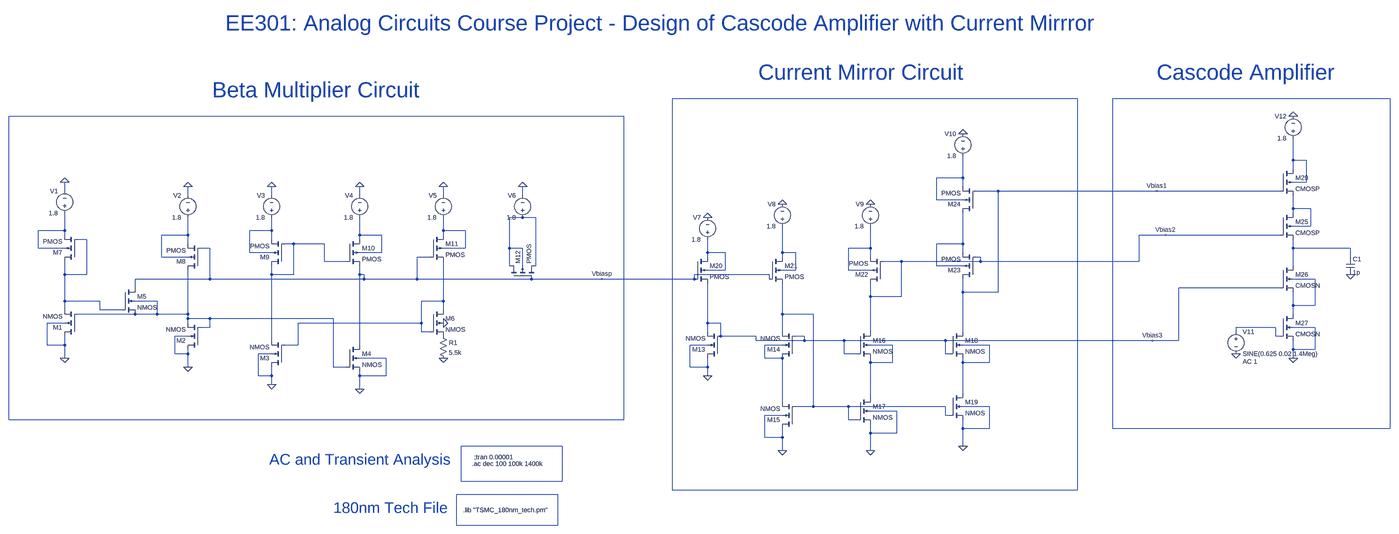
[diagram p0: schematic Cascode_Amplifier_Schematic_22nm.asc, whole sheet]
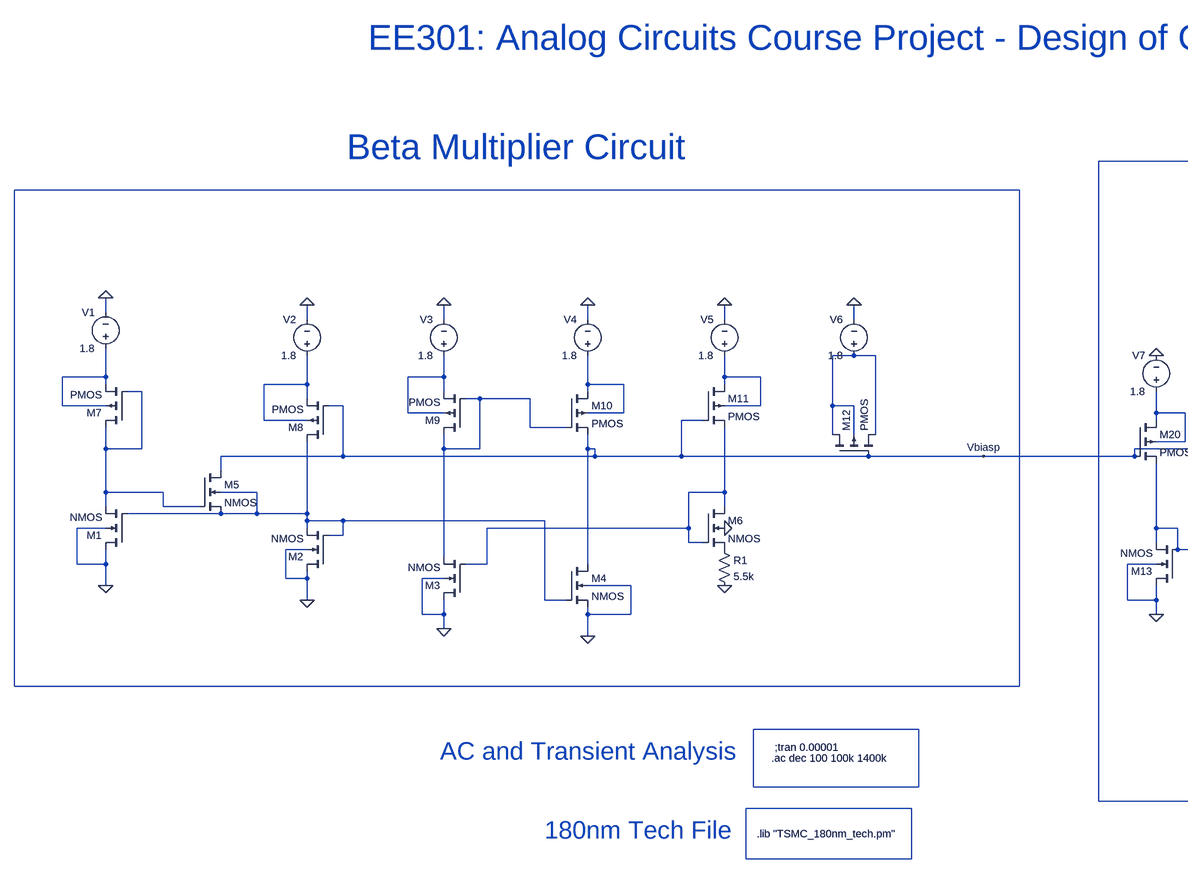
[diagram p1: schematic Cascode_Amplifier_Schematic_22nm.asc, part, row 1 of 1, column 1 of 2]
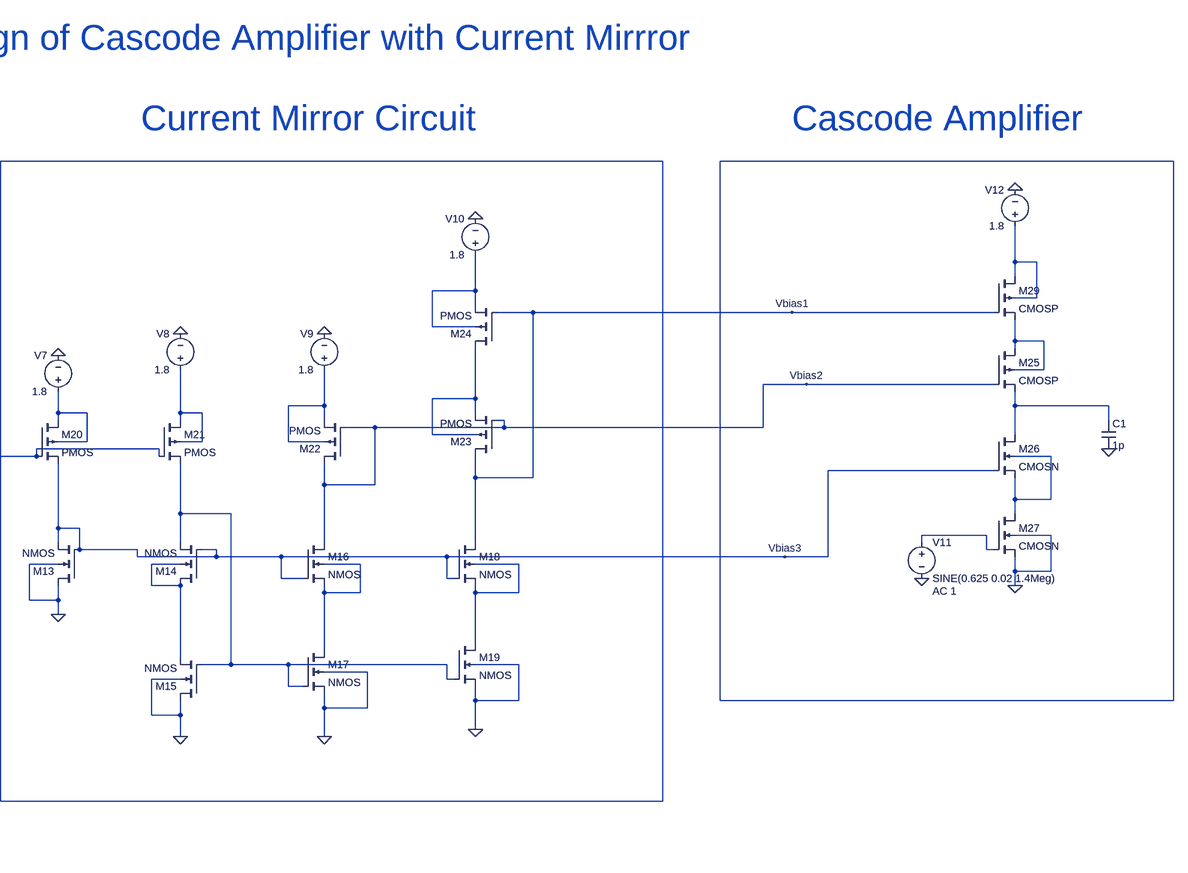
[diagram p2: schematic Cascode_Amplifier_Schematic_22nm.asc, part, row 1 of 1, column 2 of 2]
Cascode_Amplifier_Schematic_22nm.asc, the LTspice schematic file:
Version 4
SHEET 1 4960 980
WIRE 3712 -576 2240 -576
WIRE 4880 -576 3840 -576
WIRE 2064 -512 -176 -512
WIRE 4496 -352 4496 -432
WIRE 4544 -352 4496 -352
WIRE 4496 -320 4496 -352
WIRE 3296 -288 3296 -368
WIRE 3296 -288 3200 -288
WIRE 4544 -272 4544 -352
WIRE 4544 -272 4496 -272
WIRE 3296 -256 3296 -288
WIRE 32 -240 32 -272
WIRE 3424 -240 3344 -240
WIRE 4000 -240 3424 -240
WIRE 4448 -240 4000 -240
WIRE 480 -224 480 -256
WIRE 784 -224 784 -256
WIRE 1104 -224 1104 -256
WIRE 1408 -224 1408 -256
WIRE 1696 -224 1696 -256
WIRE 3200 -208 3200 -288
WIRE 3296 -208 3200 -208
WIRE 4496 -176 4496 -224
WIRE 4560 -176 4496 -176
WIRE 4496 -160 4496 -176
WIRE 1696 -144 1648 -144
WIRE 1744 -144 1696 -144
WIRE 4560 -112 4560 -176
WIRE 4560 -112 4496 -112
WIRE 32 -96 32 -160
WIRE 32 -96 -64 -96
WIRE 784 -96 784 -144
WIRE 784 -96 704 -96
WIRE 1408 -96 1408 -144
WIRE 1488 -96 1408 -96
WIRE 32 -80 32 -96
WIRE 480 -80 480 -144
WIRE 480 -80 384 -80
WIRE 1104 -80 1104 -144
WIRE 1184 -80 1104 -80
WIRE 1408 -80 1408 -96
WIRE 4032 -80 3936 -80
WIRE 4448 -80 4032 -80
WIRE 112 -64 80 -64
WIRE 784 -64 784 -96
WIRE 1104 -64 1104 -80
WIRE 480 -48 480 -80
WIRE 864 -48 832 -48
WIRE 976 -48 864 -48
WIRE 3296 -48 3296 -160
WIRE 3296 -48 3200 -48
WIRE -64 -32 -64 -96
WIRE 32 -32 -64 -32
WIRE 560 -32 528 -32
WIRE 1488 -32 1488 -96
WIRE 1488 -32 1408 -32
WIRE 1648 -32 1648 -144
WIRE 1696 -32 1648 -32
WIRE 2960 -32 2960 -112
WIRE 2960 -32 2880 -32
WIRE 4496 -32 4496 -64
WIRE 4704 -32 4496 -32
WIRE 704 -16 704 -96
WIRE 784 -16 704 -16
WIRE 1184 -16 1184 -80
WIRE 1184 -16 1104 -16
WIRE 2368 -16 2368 -64
WIRE 2432 -16 2368 -16
WIRE 2640 -16 2640 -112
WIRE 2688 -16 2640 -16
WIRE 3296 -16 3296 -48
WIRE 384 0 384 -80
WIRE 480 0 384 0
WIRE 1360 0 1312 0
WIRE 2368 0 2368 -16
WIRE 2640 0 2640 -16
WIRE 2960 0 2960 -32
WIRE 3360 0 3344 0
WIRE 4704 0 4704 -32
WIRE 976 16 976 -48
WIRE 1056 16 976 16
WIRE 3072 16 3008 16
WIRE 3360 16 3360 0
WIRE 3360 16 3072 16
WIRE 3936 16 3936 -80
WIRE 3936 16 3360 16
WIRE 1648 32 1648 -32
WIRE 1696 32 1696 -32
WIRE 1744 32 1744 -144
WIRE 3200 32 3200 -48
WIRE 3296 32 3200 32
WIRE 4496 32 4496 -32
WIRE 2432 48 2432 -16
WIRE 2432 48 2368 48
WIRE 2688 48 2688 -16
WIRE 2688 48 2640 48
WIRE 2880 48 2880 -32
WIRE 2960 48 2880 48
WIRE 32 64 32 16
WIRE 112 64 112 -64
WIRE 112 64 32 64
WIRE 784 64 784 32
WIRE 864 64 864 -48
WIRE 864 64 784 64
WIRE 1104 64 1104 32
WIRE 1120 64 1104 64
WIRE 2592 64 2320 64
WIRE 560 80 560 -32
WIRE 560 80 288 80
WIRE 1120 80 1120 64
WIRE 1120 80 560 80
WIRE 1312 80 1312 0
WIRE 1312 80 1120 80
WIRE 1728 80 1312 80
WIRE 1984 80 1728 80
WIRE 2320 80 2320 64
WIRE 2320 80 1984 80
WIRE 2592 80 2592 64
WIRE 4576 80 4496 80
WIRE 288 112 288 80
WIRE 4448 112 4080 112
WIRE 3296 128 3296 80
WIRE 3424 128 3424 -240
WIRE 3424 128 3296 128
WIRE 2960 144 2960 96
WIRE 3072 144 3072 16
WIRE 3072 144 2960 144
WIRE 32 160 32 64
WIRE 160 160 32 160
WIRE 368 160 288 160
WIRE 1408 160 1408 16
WIRE 1408 160 1328 160
WIRE 4496 176 4496 128
WIRE 4576 176 4576 80
WIRE 4576 176 4496 176
WIRE 32 192 32 160
WIRE 160 192 160 160
WIRE 240 192 160 192
WIRE 1408 192 1408 160
WIRE 288 208 80 208
WIRE 368 208 368 160
WIRE 368 208 288 208
WIRE 480 208 480 48
WIRE 480 208 368 208
WIRE 2640 208 2640 96
WIRE 2752 208 2640 208
WIRE 4496 208 4496 176
WIRE 480 224 480 208
WIRE 560 224 480 224
WIRE 1008 224 560 224
WIRE 32 240 -32 240
WIRE 480 240 480 224
WIRE 1328 240 1328 160
WIRE 1328 240 880 240
WIRE 2368 240 2368 96
WIRE 2416 240 2368 240
WIRE 560 256 560 224
WIRE 560 256 528 256
WIRE 4432 256 4288 256
WIRE 4576 256 4496 256
WIRE 1328 272 1328 240
WIRE 1360 272 1328 272
WIRE 2368 272 2368 240
WIRE 2640 272 2640 208
WIRE 2960 272 2960 144
WIRE 3296 272 3296 128
WIRE 4288 272 4288 256
WIRE 480 288 432 288
WIRE 2416 288 2416 240
WIRE 2544 288 2416 288
WIRE 2720 288 2688 288
WIRE 4432 288 4432 256
WIRE 4448 288 4432 288
WIRE 784 304 784 64
WIRE 2544 304 2544 288
WIRE 2720 304 2720 288
WIRE 2720 304 2544 304
WIRE 2864 304 2720 304
WIRE 3232 304 2864 304
WIRE 3984 304 3232 304
WIRE 4080 304 4080 112
WIRE 4080 304 3984 304
WIRE -32 320 -32 240
WIRE 32 320 32 288
WIRE 32 320 -32 320
WIRE 880 320 880 240
WIRE 880 320 832 320
WIRE 1104 320 1104 64
WIRE 2368 320 2304 320
WIRE 2640 320 2576 320
WIRE 3040 320 2960 320
WIRE 3392 320 3296 320
WIRE 4496 336 4496 304
WIRE 4576 336 4576 256
WIRE 4576 336 4496 336
WIRE 432 352 432 288
WIRE 480 352 480 336
WIRE 480 352 432 352
WIRE 784 352 736 352
WIRE 2864 352 2864 304
WIRE 2912 352 2864 352
WIRE 3232 352 3232 304
WIRE 3248 352 3232 352
WIRE 32 368 32 320
WIRE 1200 368 1104 368
WIRE 2576 368 2576 320
WIRE 2640 368 2576 368
WIRE 4496 368 4496 336
WIRE 2960 384 2960 368
WIRE 3040 384 3040 320
WIRE 3040 384 2960 384
WIRE 3296 384 3296 368
WIRE 3392 384 3392 320
WIRE 3392 384 3296 384
WIRE 480 400 480 352
WIRE 1008 400 1008 224
WIRE 1056 400 1008 400
WIRE 2304 400 2304 320
WIRE 2368 400 2368 368
WIRE 2368 400 2304 400
WIRE 736 432 736 352
WIRE 784 432 784 400
WIRE 784 432 736 432
WIRE 1104 432 1104 416
WIRE 1200 432 1200 368
WIRE 1200 432 1104 432
WIRE 2368 432 2368 400
WIRE 784 464 784 432
WIRE 1104 480 1104 432
WIRE 3296 496 3296 384
WIRE 2960 512 2960 384
WIRE 2640 528 2640 368
WIRE 2752 544 2752 208
WIRE 2752 544 2688 544
WIRE 2880 544 2752 544
WIRE 3232 544 2880 544
WIRE 3392 544 3296 544
WIRE 3056 560 2960 560
WIRE 2640 576 2576 576
WIRE 3232 576 3232 544
WIRE 3248 576 3232 576
WIRE -176 592 -176 -512
WIRE 2064 592 2064 -512
WIRE 2064 592 -176 592
WIRE 2880 592 2880 544
WIRE 2912 592 2880 592
WIRE 3296 624 3296 592
WIRE 3392 624 3392 544
WIRE 3392 624 3296 624
WIRE 3840 624 3840 -576
WIRE 4880 624 4880 -576
WIRE 4880 624 3840 624
WIRE 2960 640 2960 608
WIRE 3056 640 3056 560
WIRE 3056 640 2960 640
WIRE 2576 656 2576 576
WIRE 2640 656 2640 624
WIRE 2640 656 2576 656
WIRE 1840 688 1472 688
WIRE 3296 688 3296 624
WIRE 2640 704 2640 656
WIRE 2960 704 2960 640
WIRE 1472 816 1472 688
WIRE 1840 816 1840 688
WIRE 1840 816 1472 816
WIRE 2240 848 2240 -576
WIRE 3712 848 3712 -576
WIRE 3712 848 2240 848
WIRE 1824 864 1456 864
WIRE 1456 976 1456 864
WIRE 1824 976 1824 864
WIRE 1824 976 1456 976
FLAG 32 -272 0
FLAG 1408 368 0
FLAG 480 -256 0
FLAG 784 -256 0
FLAG 1104 -256 0
FLAG 1408 -256 0
FLAG 1696 -256 0
FLAG 1408 240 0
FLAG 32 368 0
FLAG 480 400 0
FLAG 784 464 0
FLAG 1104 480 0
FLAG 2368 432 0
FLAG 2640 704 0
FLAG 2960 704 0
FLAG 3296 688 0
FLAG 2368 -144 0
FLAG 2640 -192 0
FLAG 2960 -192 0
FLAG 3296 -448 0
FLAG 4496 368 0
FLAG 4288 352 0
FLAG 4496 -512 0
FLAG 4704 64 0
FLAG 1984 80 Vbiasp
FLAG 4000 -240 Vbias1
FLAG 4032 -80 Vbias2
FLAG 3984 304 Vbias3
SYMBOL voltage 32 -144 R180
WINDOW 0 24 96 Left 2
WINDOW 3 24 16 Left 2
WINDOW 123 0 0 Left 0
WINDOW 39 0 0 Left 0
SYMATTR InstName V1
SYMATTR Value 1.8
SYMBOL res 1392 272 R0
SYMATTR InstName R1
SYMATTR Value 5.5k
SYMBOL voltage 480 -128 R180
WINDOW 0 24 96 Left 2
WINDOW 3 24 16 Left 2
WINDOW 123 0 0 Left 0
WINDOW 39 0 0 Left 0
SYMATTR InstName V2
SYMATTR Value 1.8
SYMBOL voltage 784 -128 R180
WINDOW 0 24 96 Left 2
WINDOW 3 24 16 Left 2
WINDOW 123 0 0 Left 0
WINDOW 39 0 0 Left 0
SYMATTR InstName V3
SYMATTR Value 1.8
SYMBOL voltage 1104 -128 R180
WINDOW 0 24 96 Left 2
WINDOW 3 24 16 Left 2
WINDOW 123 0 0 Left 0
WINDOW 39 0 0 Left 0
SYMATTR InstName V4
SYMATTR Value 1.8
SYMBOL voltage 1408 -128 R180
WINDOW 0 24 96 Left 2
WINDOW 3 24 16 Left 2
WINDOW 123 0 0 Left 0
WINDOW 39 0 0 Left 0
SYMATTR InstName V5
SYMATTR Value 1.8
SYMBOL voltage 1696 -128 R180
WINDOW 0 24 96 Left 2
WINDOW 3 24 16 Left 2
WINDOW 123 0 0 Left 0
WINDOW 39 0 0 Left 0
SYMATTR InstName V6
SYMATTR Value 1.8
SYMBOL nmos4 1360 192 R0
SYMATTR InstName M6
SYMATTR Value2 l=180n w=2700n
SYMBOL pmos4 80 16 R180
SYMATTR InstName M7
SYMATTR Value2 l=180n w=90n
SYMBOL pmos4 528 48 R180
SYMATTR InstName M8
SYMATTR Value2 l=180n w=2160n
SYMBOL pmos4 832 32 R180
SYMATTR InstName M9
SYMATTR Value2 l=180n w=2160n
SYMBOL pmos4 1056 -64 R0
SYMATTR InstName M10
SYMATTR Value2 l=180n w=2160n
SYMBOL pmos4 1360 -80 R0
SYMATTR InstName M11
SYMATTR Value2 l=180n w=2160n
SYMBOL pmos4 1648 80 R270
SYMATTR InstName M12
SYMATTR Value2 l=180n w=180n
SYMBOL nmos4 80 288 R180
SYMATTR InstName M1
SYMATTR Value2 l=180n w=900n
SYMBOL nmos4 528 336 R180
SYMATTR InstName M2
SYMATTR Value2 l=180n w=900n
SYMBOL nmos4 832 400 R180
SYMATTR InstName M3
SYMATTR Value2 l=180n w=900n
SYMBOL nmos4 1056 320 R0
SYMATTR InstName M4
SYMATTR Value2 l=180n w=900n
SYMBOL nmos4 240 112 R0
SYMATTR InstName M5
SYMATTR Value2 l=180n w=360n
SYMBOL nmos4 2416 368 R180
SYMATTR InstName M13
SYMATTR Value2 l=360n w=5760n
SYMBOL nmos4 2688 368 R180
SYMATTR InstName M14
SYMATTR Value2 l=360n w=1800n
SYMBOL nmos4 2688 624 R180
SYMATTR InstName M15
SYMATTR Value2 l=360n w=1800n
SYMBOL nmos4 2912 272 R0
SYMATTR InstName M16
SYMATTR Value2 l=180n w=180n
SYMBOL nmos4 2912 512 R0
SYMATTR InstName M17
SYMATTR Value2 l=360n w=1800n
SYMBOL nmos4 3248 272 R0
SYMATTR InstName M18
SYMATTR Value2 l=360n w=1800n
SYMBOL nmos4 3248 496 R0
SYMATTR InstName M19
SYMATTR Value2 l=360n w=1800n
SYMBOL pmos4 2320 0 R0
SYMATTR InstName M20
SYMATTR Value2 l=360n w=4320n
SYMBOL pmos4 2592 0 R0
SYMATTR InstName M21
SYMATTR Value2 l=360n w=4320n
SYMBOL pmos4 3008 96 R180
SYMATTR InstName M22
SYMATTR Value2 l=1800n w=1350n
SYMBOL pmos4 3344 80 R180
SYMATTR InstName M23
SYMATTR Value2 l=360n w=4500n
SYMBOL pmos4 3344 -160 R180
SYMATTR InstName M24
SYMATTR Value2 l=540n w=2250n
SYMBOL voltage 2368 -48 R180
WINDOW 0 24 96 Left 2
WINDOW 3 24 16 Left 2
WINDOW 123 0 0 Left 0
WINDOW 39 0 0 Left 0
SYMATTR InstName V7
SYMATTR Value 1.8
SYMBOL voltage 2640 -96 R180
WINDOW 0 24 96 Left 2
WINDOW 3 24 16 Left 2
WINDOW 123 0 0 Left 0
WINDOW 39 0 0 Left 0
SYMATTR InstName V8
SYMATTR Value 1.8
SYMBOL voltage 2960 -96 R180
WINDOW 0 24 96 Left 2
WINDOW 3 24 16 Left 2
WINDOW 123 0 0 Left 0
WINDOW 39 0 0 Left 0
SYMATTR InstName V9
SYMATTR Value 1.8
SYMBOL voltage 3296 -352 R180
WINDOW 0 24 96 Left 2
WINDOW 3 24 16 Left 2
WINDOW 123 0 0 Left 0
WINDOW 39 0 0 Left 0
SYMATTR InstName V10
SYMATTR Value 1.8
SYMBOL cap 4688 0 R0
SYMATTR InstName C1
SYMATTR Value 1p
SYMBOL voltage 4288 256 R0
WINDOW 123 24 124 Left 2
WINDOW 39 0 0 Left 0
SYMATTR Value2 AC 1
SYMATTR InstName V11
SYMATTR Value SINE(0.625 0.02 1.4Meg)
SYMBOL voltage 4496 -416 R180
WINDOW 0 24 96 Left 2
WINDOW 3 24 16 Left 2
WINDOW 123 0 0 Left 0
WINDOW 39 0 0 Left 0
SYMATTR InstName V12
SYMATTR Value 1.8
SYMBOL pmos4 4448 -320 R0
SYMATTR InstName M29
SYMATTR Value2 l=180e-9 w=1584e-9
SYMATTR Value CMOSP
SYMBOL pmos4 4448 -160 R0
SYMATTR InstName M25
SYMATTR Value2 l=180e-9 w=1584e-9
SYMATTR Value CMOSP
SYMBOL nmos4 4448 32 R0
SYMATTR InstName M26
SYMATTR Value2 l=180e-9 w=1287e-9
SYMATTR Value CMOSN
SYMBOL nmos4 4448 208 R0
SYMATTR InstName M27
SYMATTR Value2 l=180e-9 w=1287e-9
SYMATTR Value CMOSN
TEXT 1520 728 Left 2 !;tran 0.00001
TEXT 1512 752 Left 2 !.ac dec 100 100k 1400k
TEXT 1480 920 Left 2 !.lib "TSMC_180nm_tech.pm"
TEXT 568 -608 Left 6 ;Beta Multiplier Circuit
TEXT 2552 -672 Left 6 ;Current Mirror Circuit
TEXT 4000 -672 Left 6 ;Cascode Amplifier
TEXT 776 736 Left 5 ;AC and Transient Analysis
TEXT 1008 912 Left 5 ;180nm Tech File
TEXT 616 -936 Left 6 ;EE301: Analog Circuits Course Project - Design of Cascode Amplifier with Current Mirrror

The netlist it stands for:
* Cascode_Amplifier_Schematic_22nm.asc
V1 N008 0 1.8
R1 P001 0 5.5k
V2 N011 0 1.8
V3 N009 0 1.8
V4 N012 0 1.8
V5 N010 0 1.8
V6 N007 0 1.8
M6 N022 N022 P001 0 NMOS l=180n w=2700n
M7 N013 N013 N008 N008 PMOS l=180n w=90n
M8 N021 Vbiasp N011 N011 PMOS l=180n w=2160n
M9 N014 N014 N009 N009 PMOS l=180n w=2160n
M10 N012 N014 Vbiasp N012 PMOS l=180n w=2160n
M11 N010 Vbiasp N022 N010 PMOS l=180n w=2160n
M12 N007 Vbiasp N007 N007 PMOS l=180n w=180n
M1 0 N021 N013 0 NMOS l=180n w=900n
M2 0 N021 N021 0 NMOS l=180n w=900n
M3 0 N022 N014 0 NMOS l=180n w=900n
M4 Vbiasp N021 0 0 NMOS l=180n w=900n
M5 Vbiasp N013 N021 N021 NMOS l=180n w=360n
M13 0 Vbias3 Vbias3 0 NMOS l=360n w=5760n
M14 N025 Vbias3 N023 N025 NMOS l=360n w=1800n
M15 0 N023 N025 0 NMOS l=360n w=1800n
M16 Vbias2 Vbias3 N026 N026 NMOS l=180n w=180n
M17 N026 N023 0 0 NMOS l=360n w=1800n
M18 Vbias1 Vbias3 N027 N027 NMOS l=360n w=1800n
M19 N027 N023 0 0 NMOS l=360n w=1800n
M20 N018 Vbiasp Vbias3 N018 PMOS l=360n w=4320n
M21 N019 Vbiasp N023 N019 PMOS l=360n w=4320n
M22 Vbias2 Vbias2 N016 N016 PMOS l=1800n w=1350n
M23 Vbias1 Vbias2 N015 N015 PMOS l=360n w=4500n
M24 N015 Vbias1 N005 N005 PMOS l=540n w=2250n
V7 N018 0 1.8
V8 N019 0 1.8
V9 N016 0 1.8
V10 N005 0 1.8
C1 N017 0 1p
V11 N024 0 SINE(0.625 0.02 1.4Meg) AC 1
V12 N004 0 1.8
M29 N004 Vbias1 N006 N004 CMOSP l=180e-9 w=1584e-9
M25 N006 Vbias2 N017 N006 CMOSP l=180e-9 w=1584e-9
M26 N017 Vbias3 N020 N020 CMOSN l=180e-9 w=1287e-9
M27 N020 N024 0 0 CMOSN l=180e-9 w=1287e-9
.model NMOS NMOS
.model PMOS PMOS
.lib standard.mos
;tran 0.00001
.ac dec 100 100k 1400k
.lib "TSMC_180nm_tech.pm"
* Beta Multiplier Circuit
* Current Mirror Circuit
* Cascode Amplifier
* AC and Transient Analysis
* 180nm Tech File
* EE301: Analog Circuits Course Project - Design of Cascode Amplifier with Current Mirrror
.backanno
.end